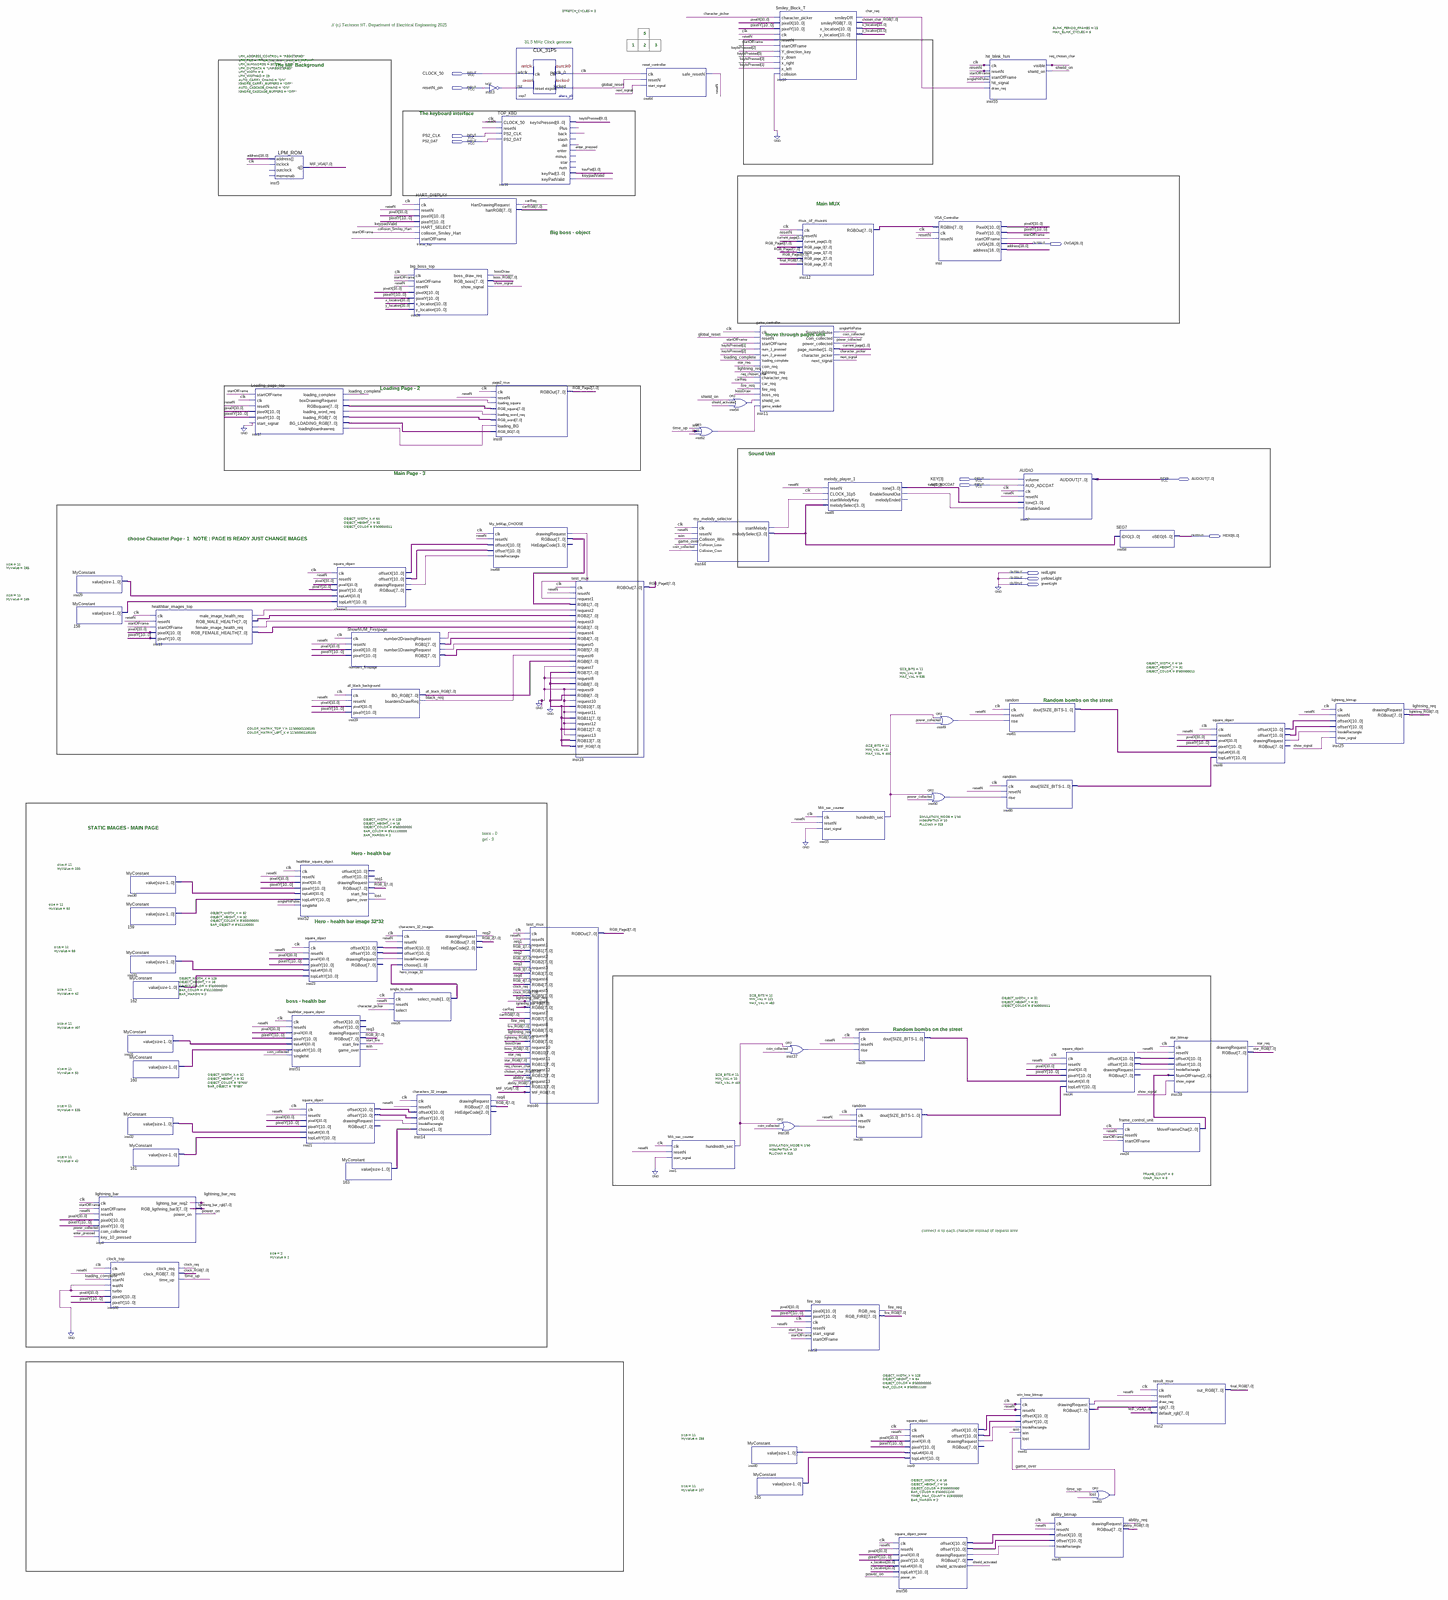
[diagram p0: schematic sheet, whole]
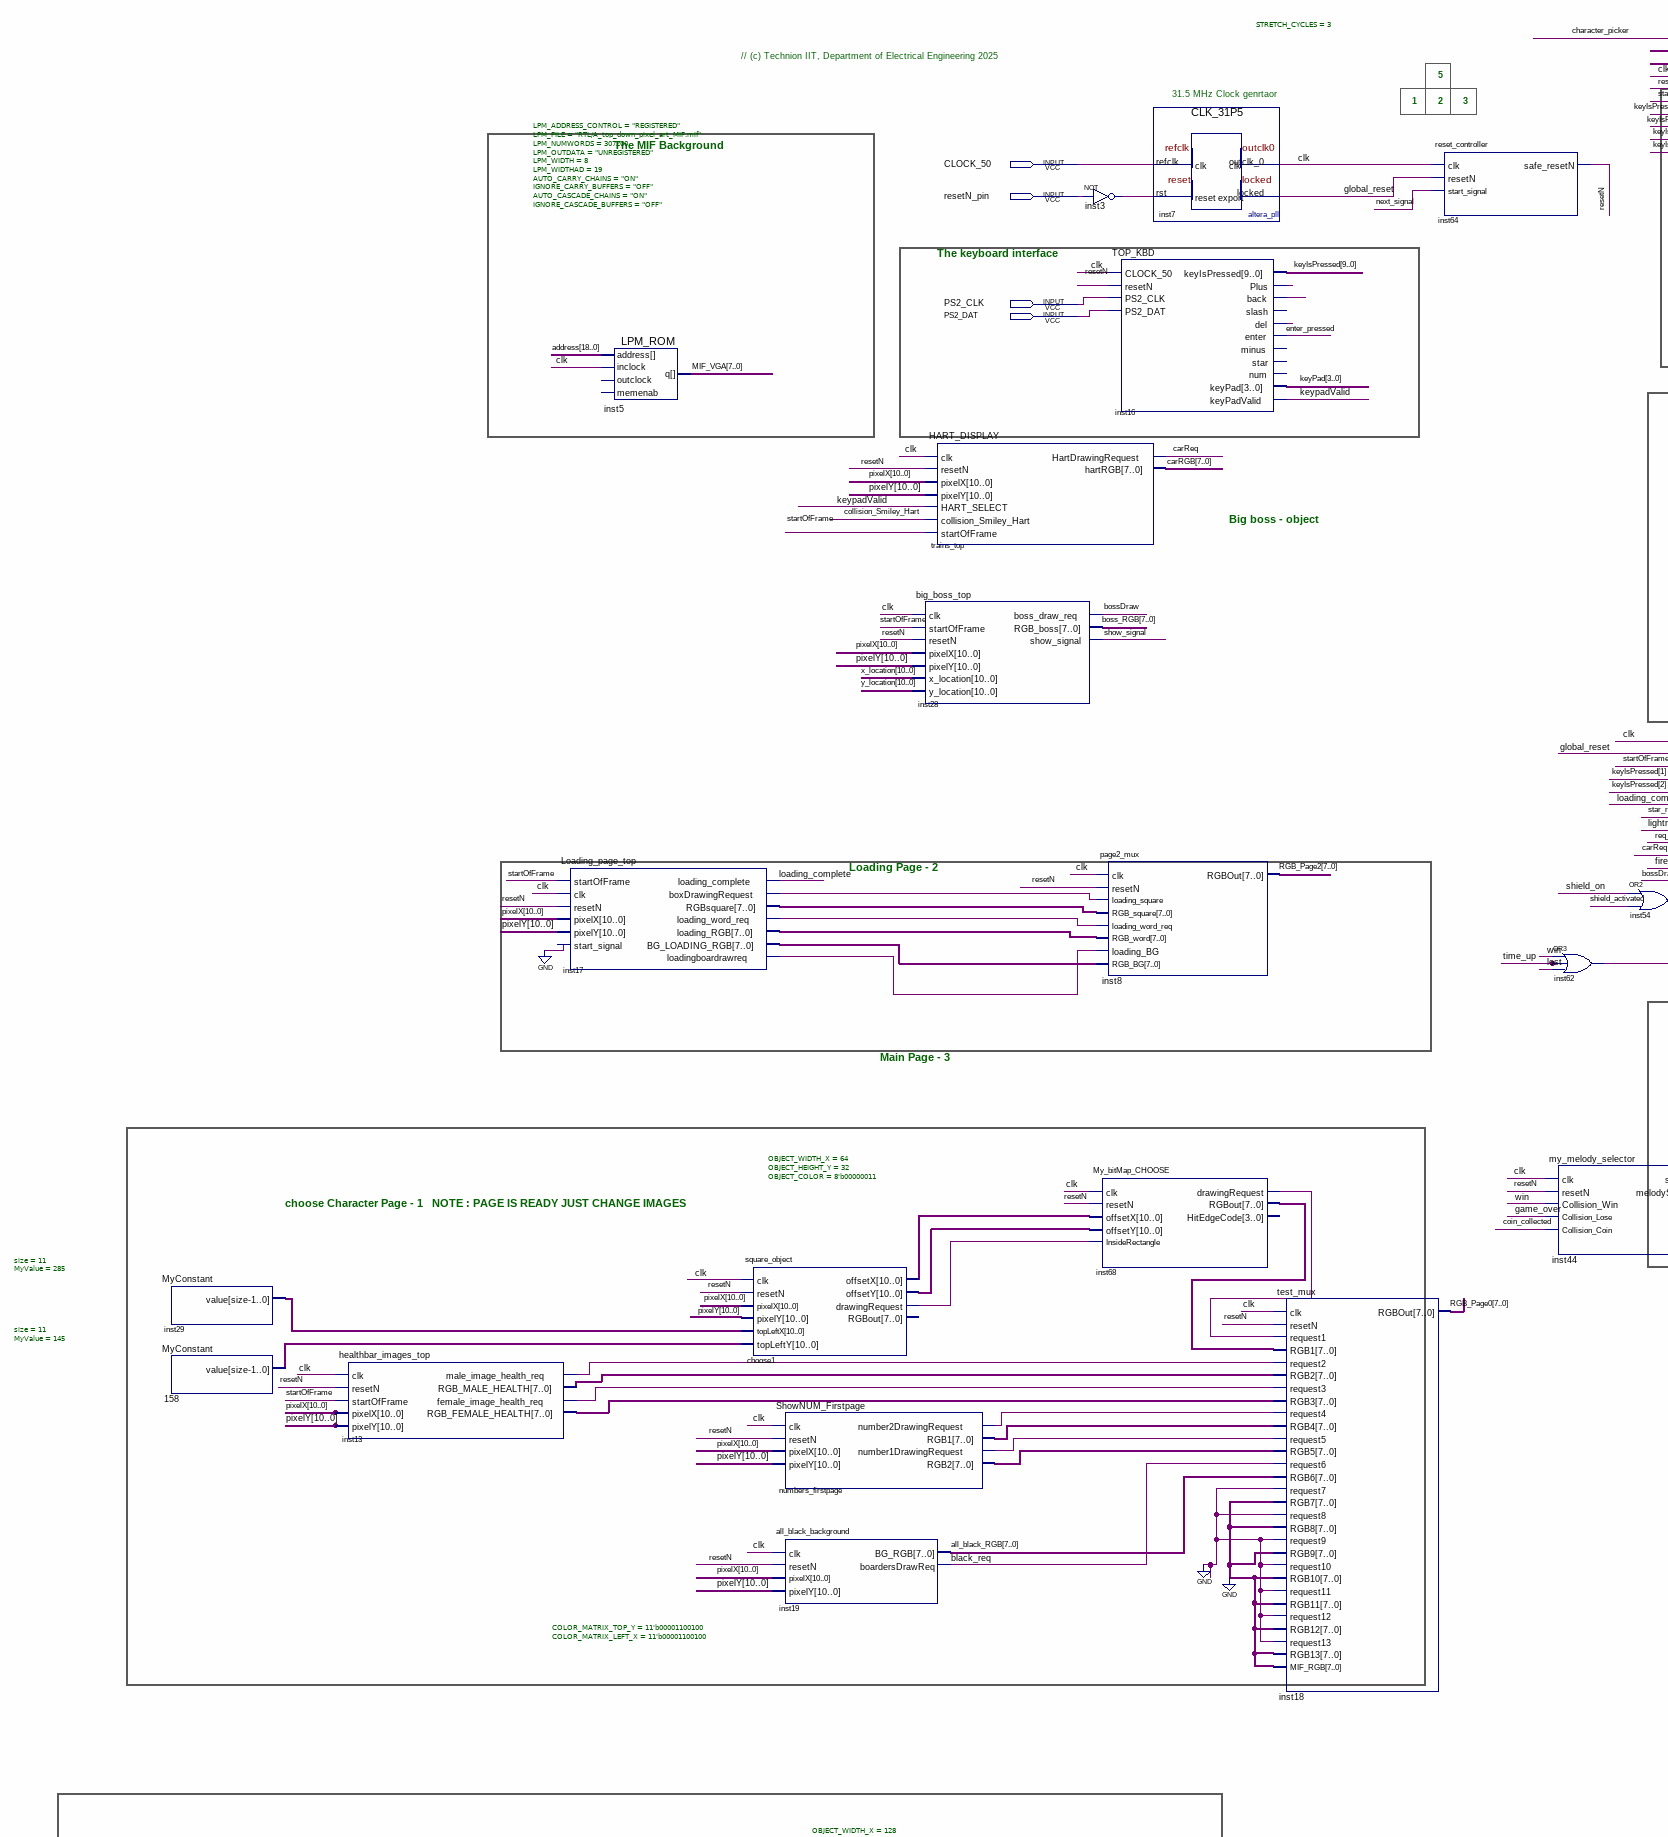
[diagram p1: schematic sheet, upper left part]
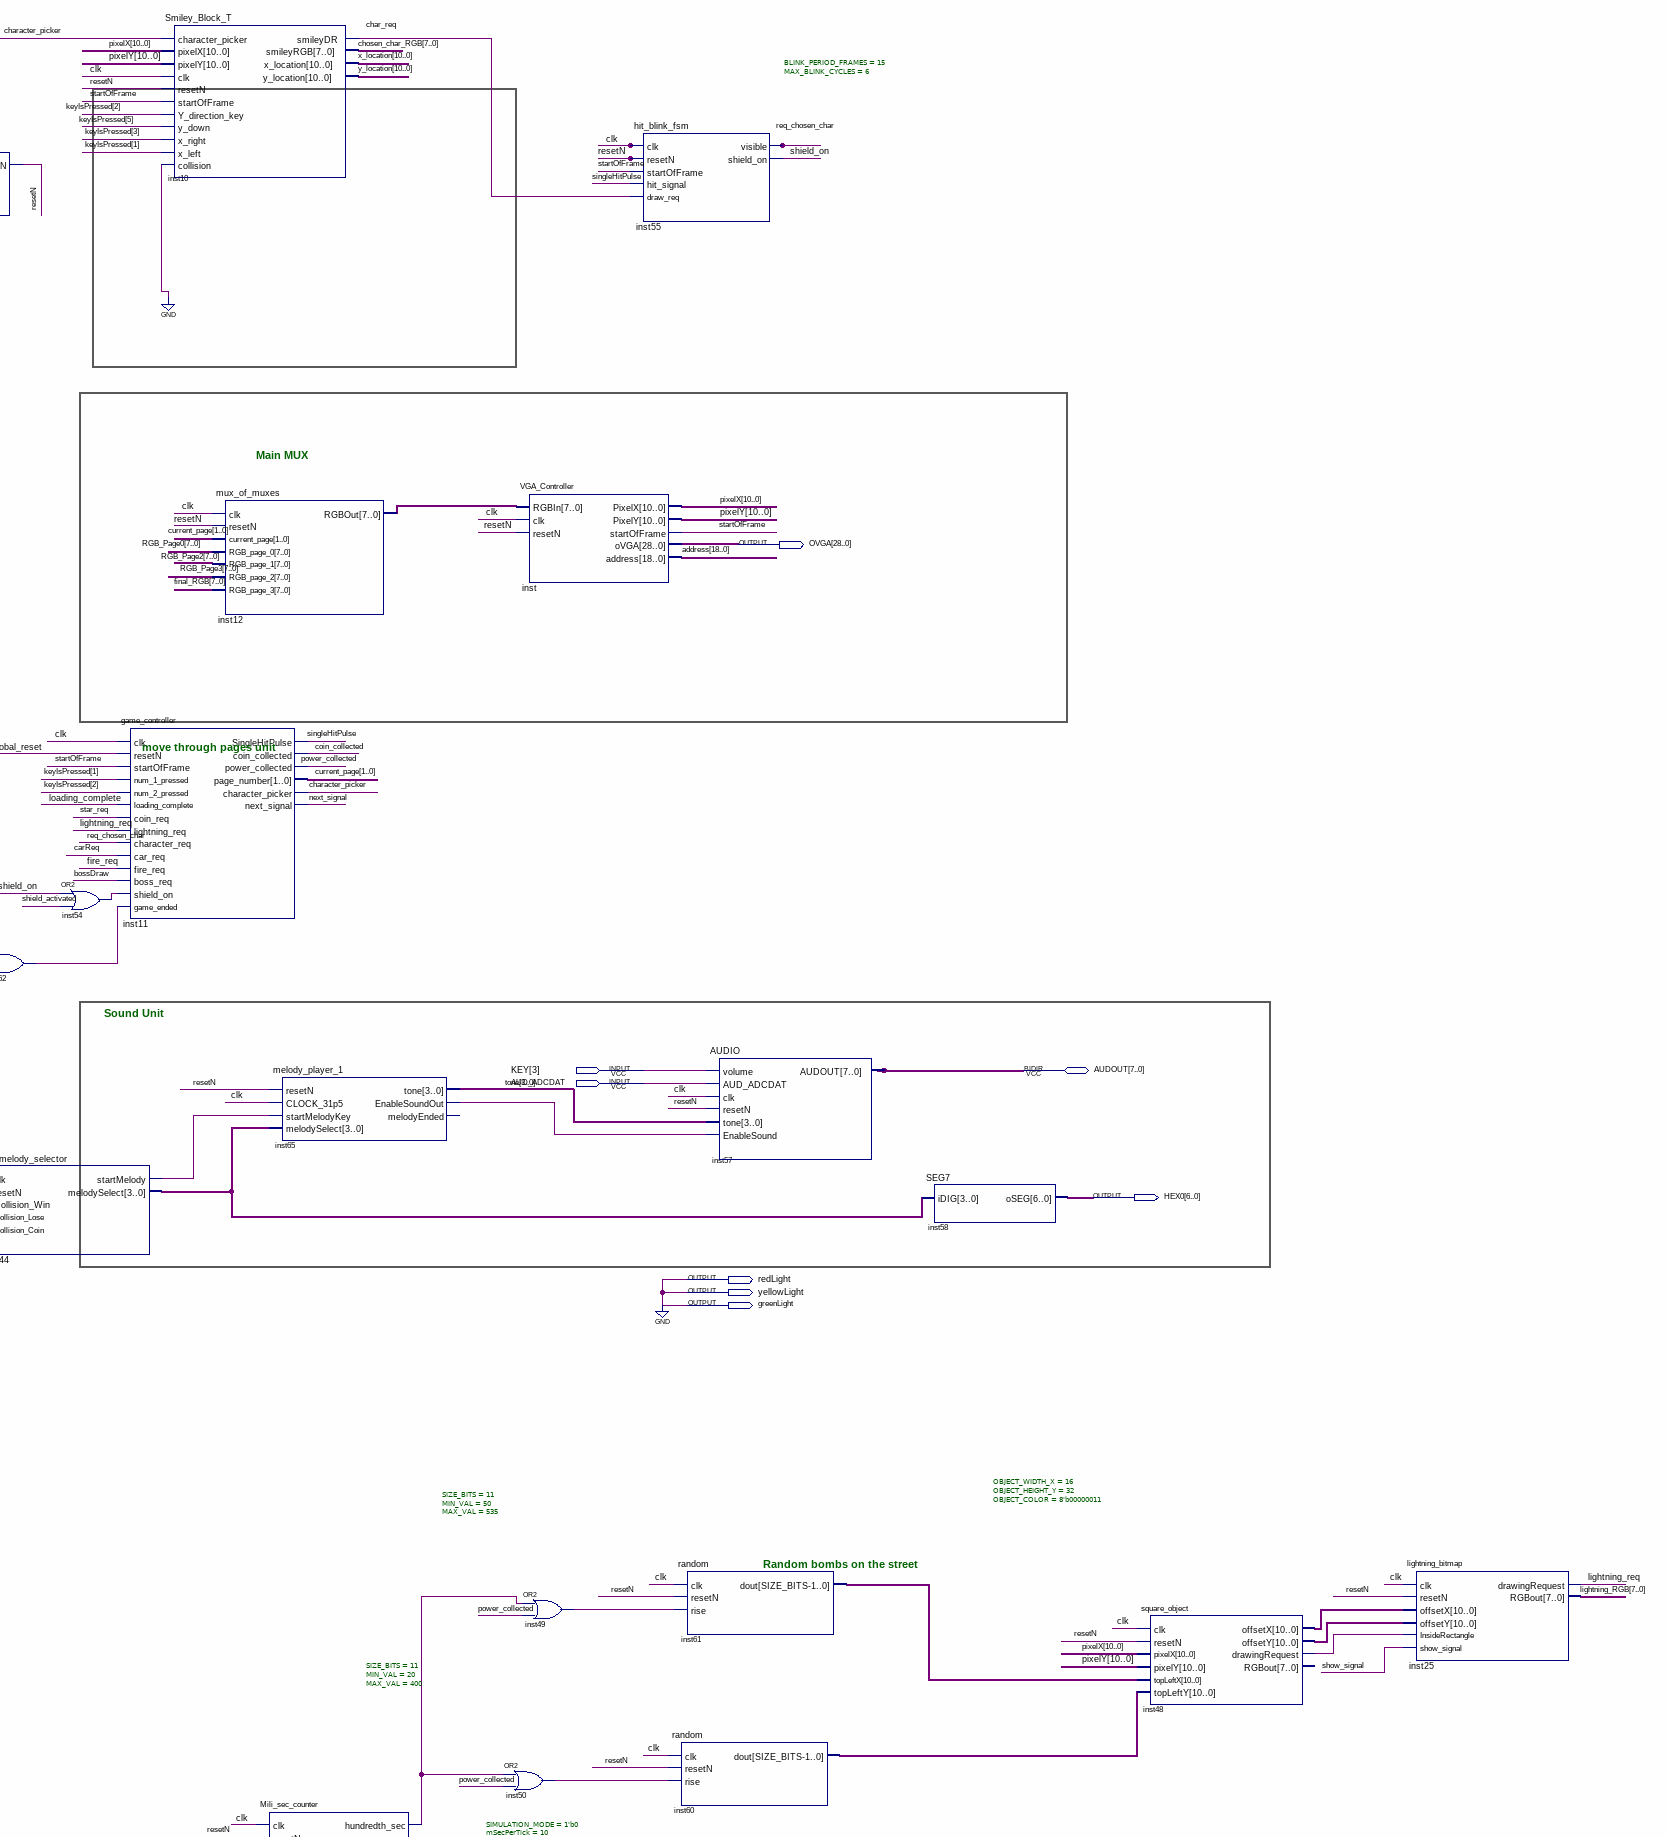
[diagram p2: schematic sheet, upper right part]
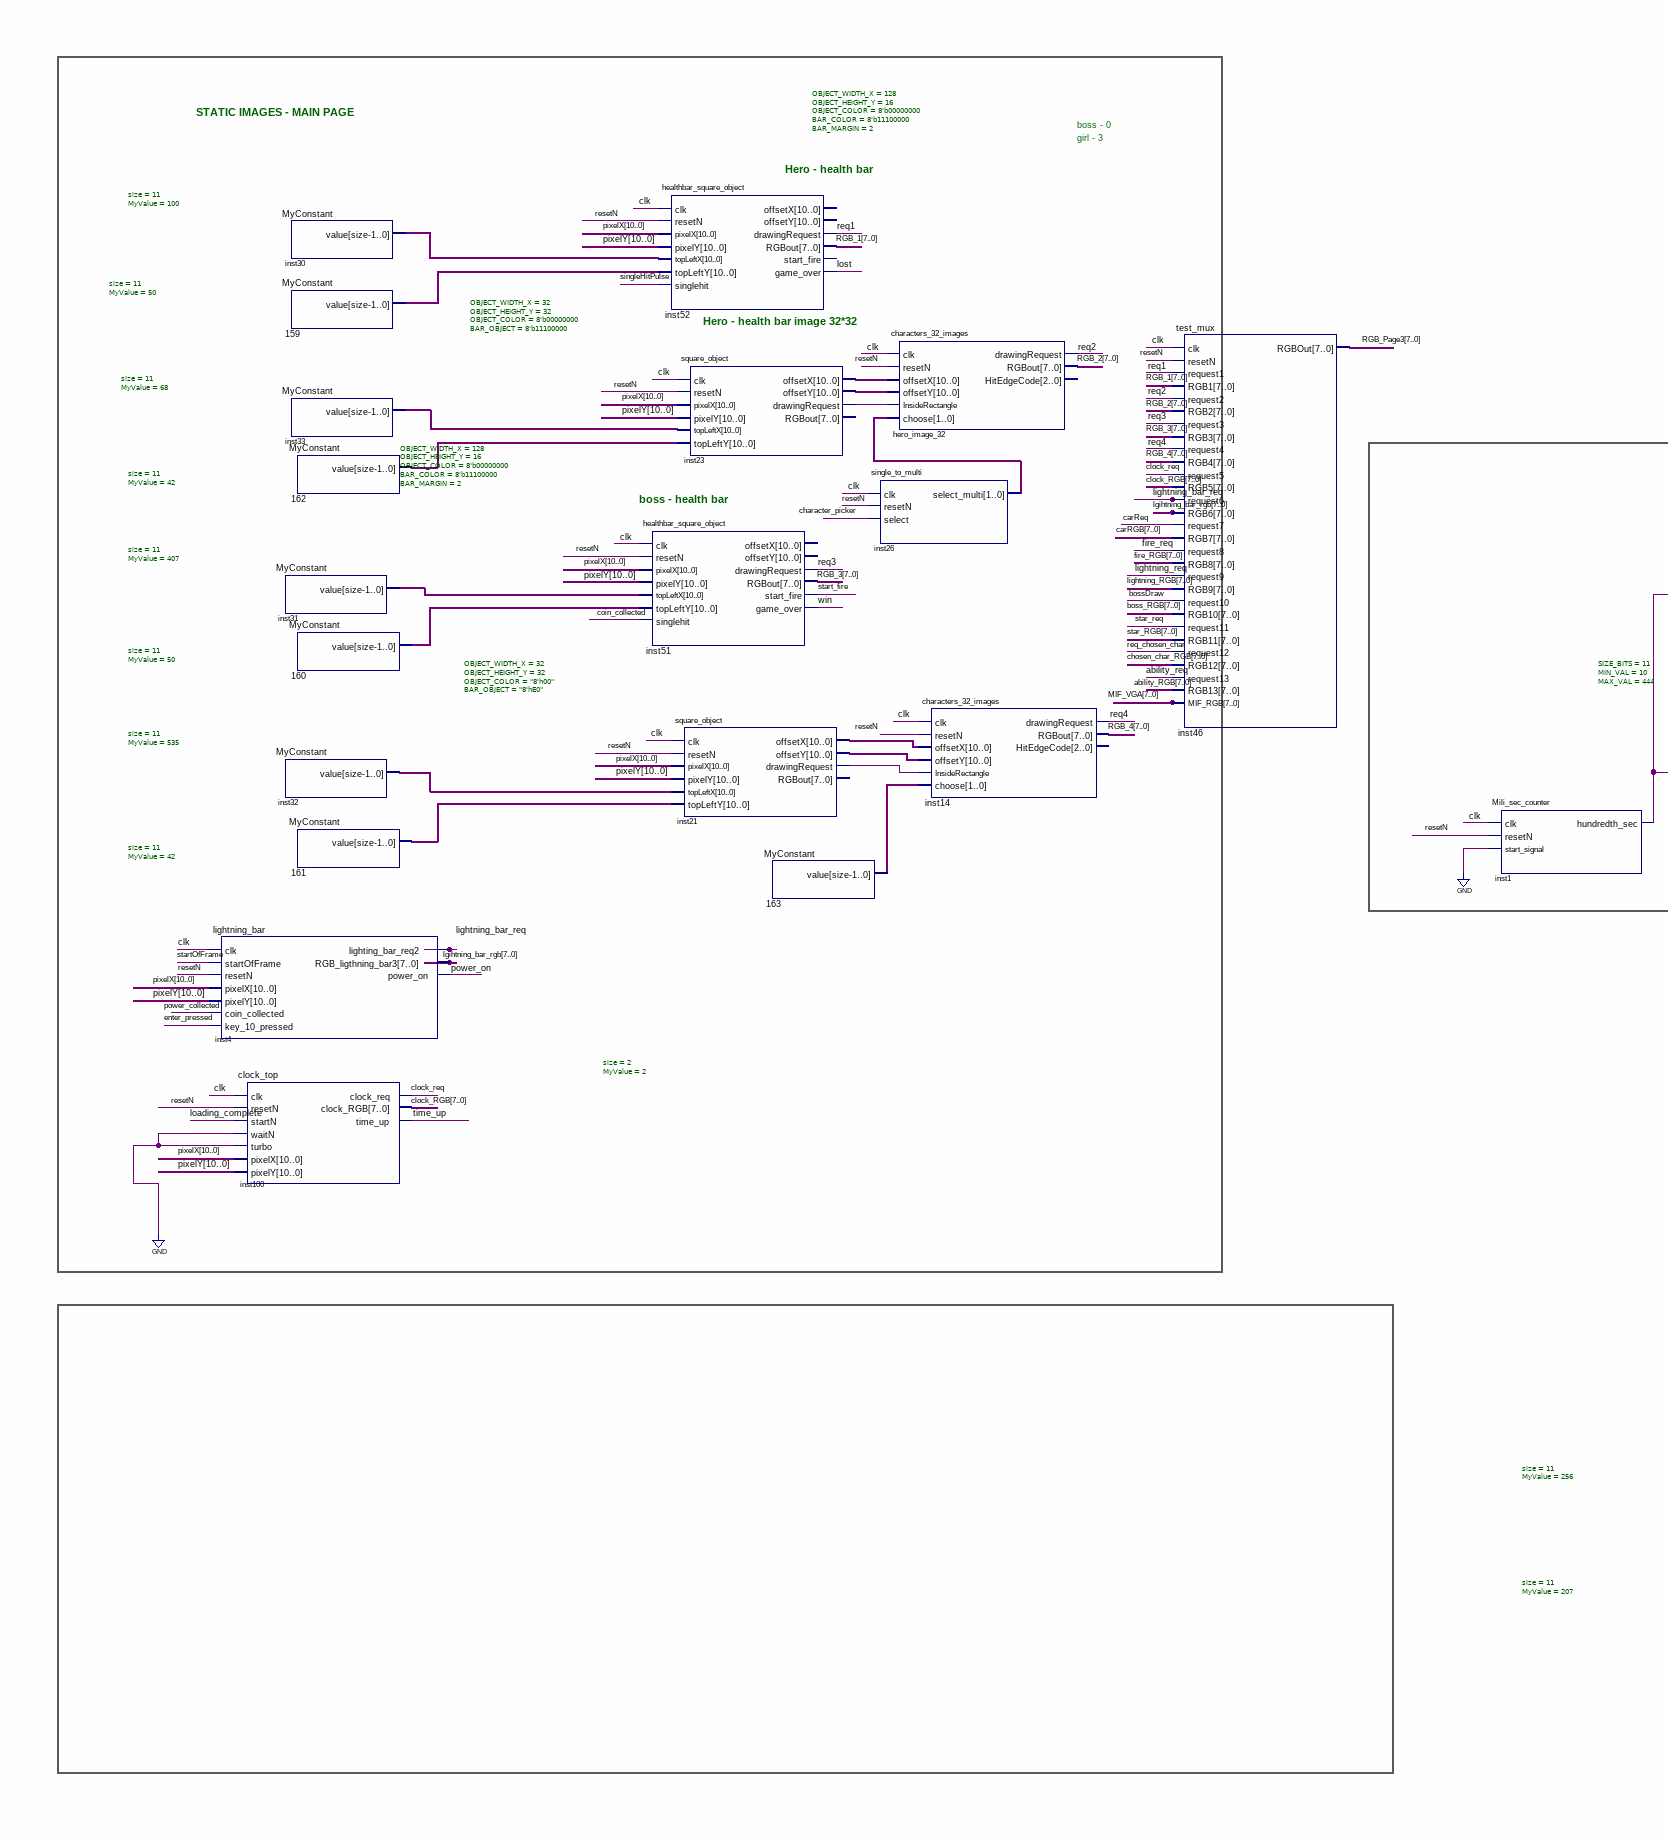
[diagram p3: schematic sheet, lower left part]
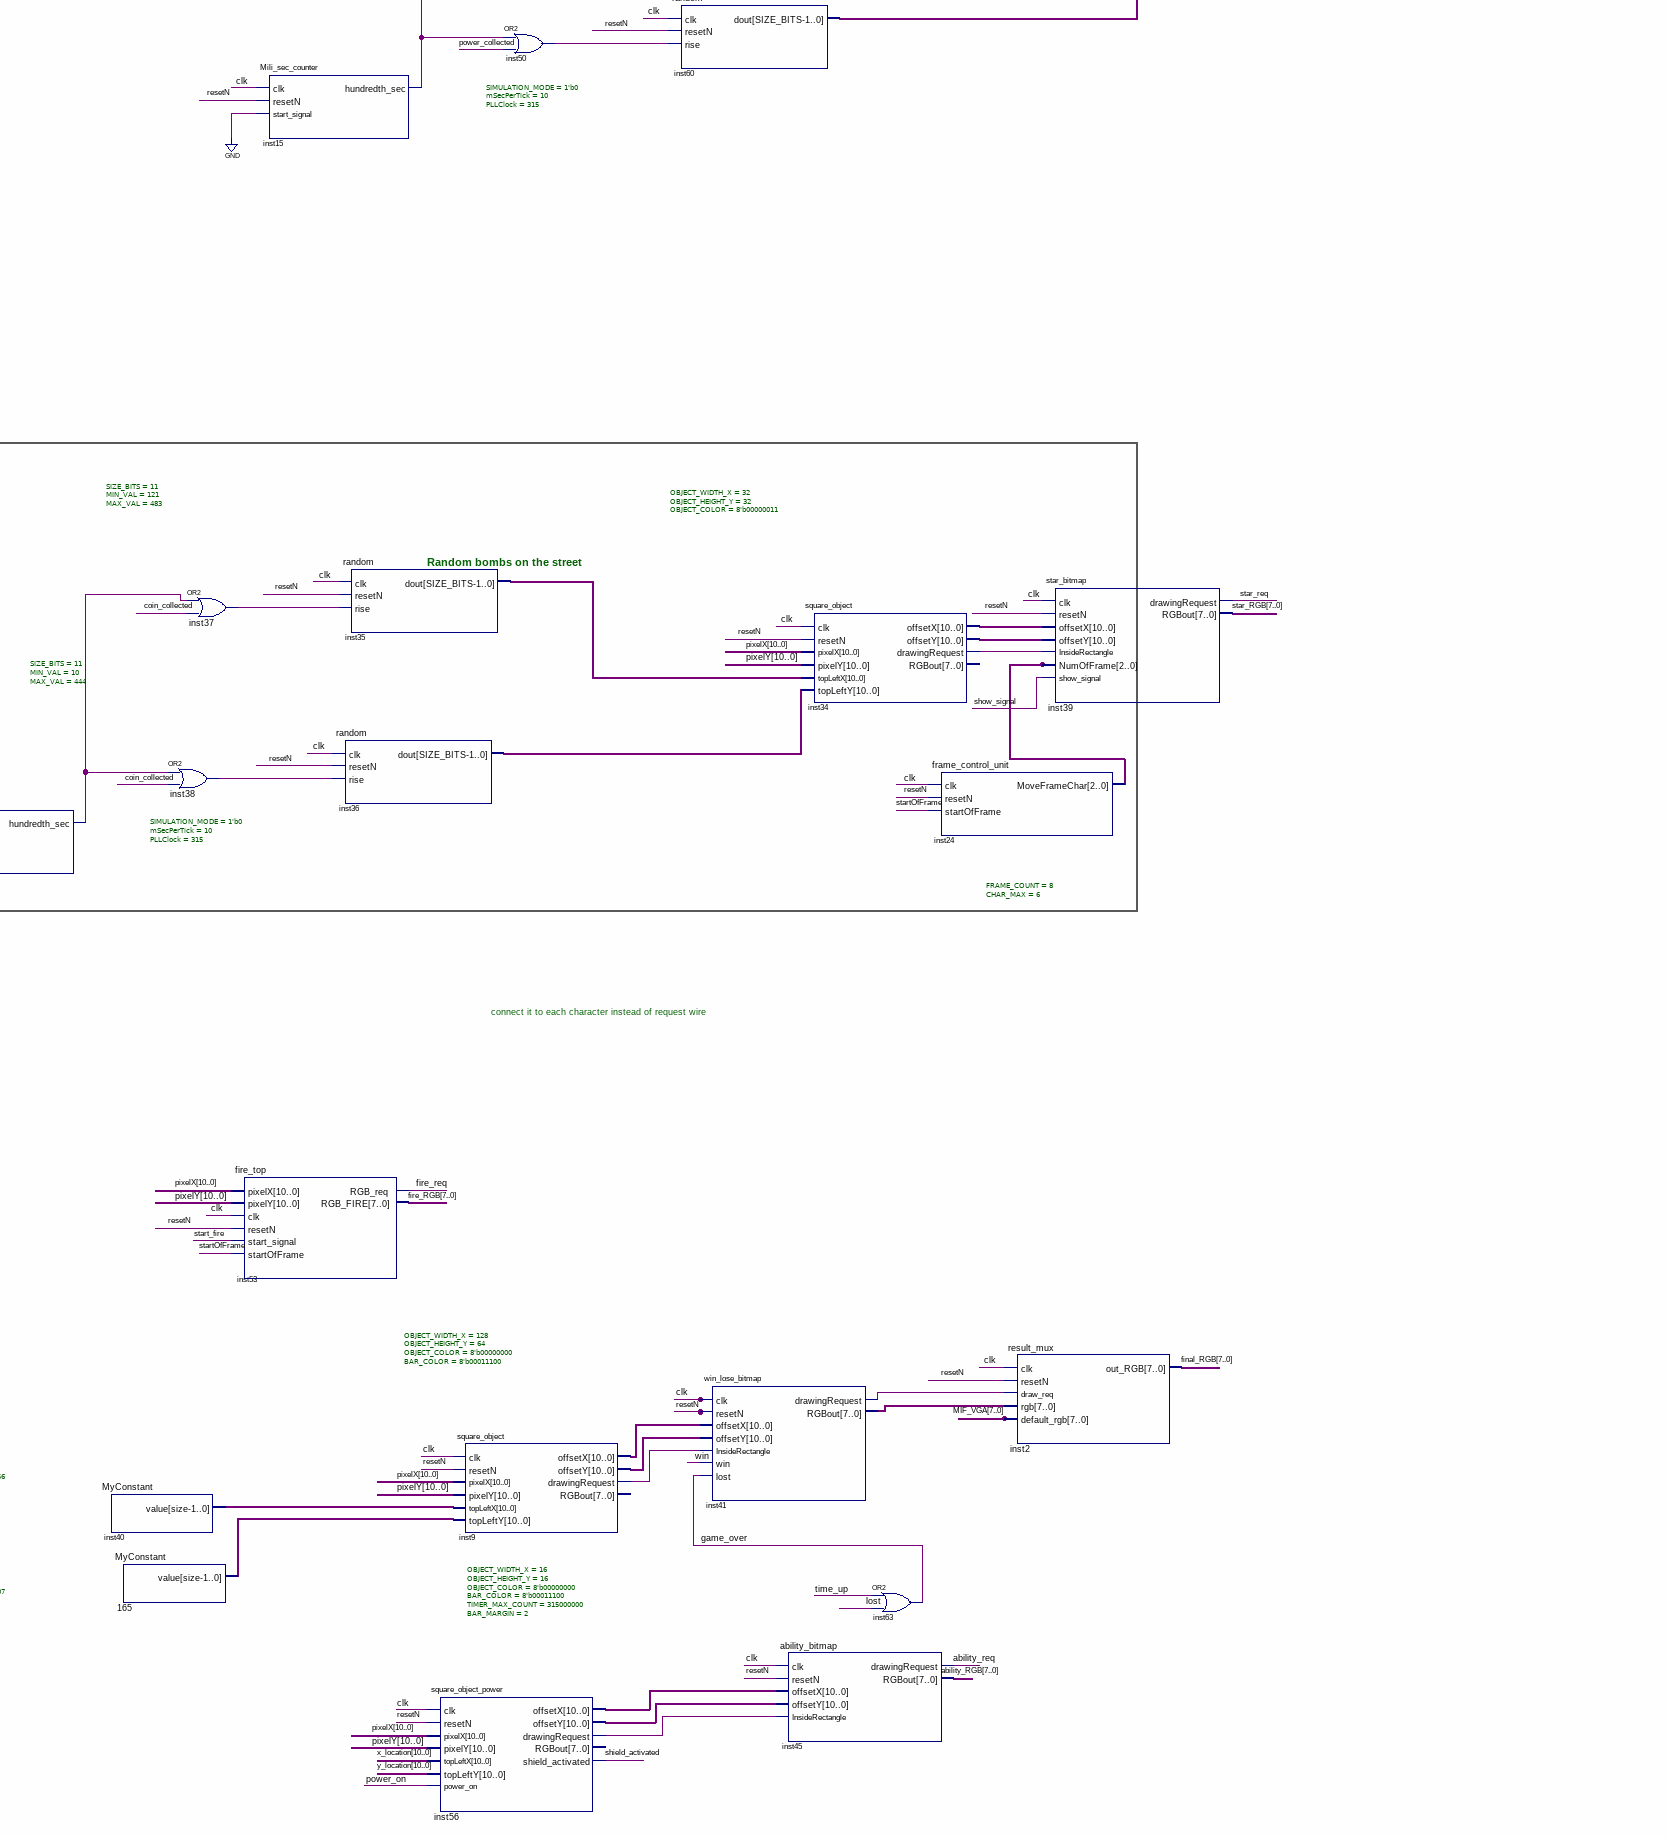
[diagram p4: schematic sheet, lower right part]
// Quartus schematic TOP_VGA_DEMO_KBD.bdf as structural Verilog: 71 symbols, 12 pins
module TOP_VGA_DEMO_KBD (
  input  CLOCK_50,
  input  resetN_pin,
  input  PS2_CLK,
  input  PS2_DAT,
  input  [3:3] KEY,
  input  AUD_ADCDAT,
  inout  [7:0] AUDOUT,
  output [28:0] OVGA,
  output [6:0] HEX0,
  output redLight,
  output yellowLight,
  output greenLight
);

  wire ability_req, black_req, bossDraw, carReq, char_req, character_picker, choose1_drawingrequest, clk,
       clock_req, coin_collected, collision_Smiley_Hart, enter_pressed, fire_req, game_over, global_reset,
       inst1_hundredth_sec, inst3_out, inst9_drawingrequest, inst13_female_image_health_req,
       inst13_male_image_health_req, inst15_hundredth_sec, inst16_back, inst16_del, inst16_plus,
       inst17_boxdrawingrequest, inst17_loading_word_req, inst17_loadingboardrawreq, inst21_drawingrequest,
       inst23_drawingrequest, inst34_drawingrequest, inst37_out, inst38_out, inst41_drawingrequest,
       inst44_startmelody, inst48_drawingrequest, inst49_out, inst50_out, inst54_out, inst56_drawingrequest,
       inst62_out, inst65_enablesoundout, inst68_drawingrequest, keypadValid, lightning_bar_req,
       lightning_req, loading_complete, lost, next_signal, numbers_firstpage_number1drawingrequest,
       numbers_firstpage_number2drawingrequest, power_collected, power_on, req1, req2, req3, req4,
       req_chosen_char, resetN, shield_activated, shield_on, show_signal, singleHitPulse, star_req,
       start_fire, startOfFrame, time_up, win;
  wire [1:0] current_page, inst26_select_multi, n163_value;
  wire [2:0] inst24_moveframechar;
  wire [3:0] inst44_melodyselect, keyPad, tone;
  wire [7:0] ability_RGB, all_black_RGB, boss_RGB, carRGB, chosen_char_RGB, clock_RGB, final_RGB, fire_RGB,
       inst12_rgbout, inst13_rgb_female_health, inst13_rgb_male_health, inst17_bg_loading_rgb,
       inst17_loading_rgb, inst17_rgbsquare, inst41_rgbout, inst68_rgbout, lgihtning_bar_rgb, lightning_RGB,
       MIF_VGA, numbers_firstpage_rgb1, numbers_firstpage_rgb2, RGB_1, RGB_2, RGB_3, RGB_4, RGB_Page0,
       RGB_Page2, RGB_Page3, star_RGB;
  wire [9:0] keyIsPressed;
  wire [10:0] choose1_offsetx, choose1_offsety, inst9_offsetx, inst9_offsety, inst21_offsetx, inst21_offsety,
       inst23_offsetx, inst23_offsety, inst29_value, inst30_value, inst31_value, inst32_value, inst33_value,
       inst34_offsetx, inst34_offsety, inst35_dout, inst36_dout, inst40_value, inst48_offsetx,
       inst48_offsety, inst56_offsetx, inst56_offsety, inst60_dout, inst61_dout, n158_value, n159_value,
       n160_value, n161_value, n162_value, n165_value, pixelX, pixelY, x_location, y_location;
  wire [18:0] address;

  MyConstant #(.size(11), .MyValue(285)) inst29 (.value(inst29_value));
  MyConstant #(.size(11), .MyValue(145)) u_158 (.value(n158_value));
  lightning_bar inst4 (
    .clk(clk), .startOfFrame(startOfFrame), .resetN(resetN), .pixelX(pixelX), .pixelY(pixelY),
    .coin_collected(power_collected), .key_10_pressed(enter_pressed), .lighting_bar_req2(lightning_bar_req),
    .RGB_ligthning_bar3(lgihtning_bar_rgb), .power_on(power_on));
  MyConstant #(.size(11), .MyValue(100)) inst30 (.value(inst30_value));
  MyConstant #(.size(11), .MyValue(50)) u_159 (.value(n159_value));
  MyConstant #(.size(11), .MyValue(68)) inst33 (.value(inst33_value));
  MyConstant #(.size(11), .MyValue(407)) inst31 (.value(inst31_value));
  MyConstant #(.size(11), .MyValue(535)) inst32 (.value(inst32_value));
  clock_top inst100 (
    .clk(clk), .resetN(resetN), .startN(loading_complete), .waitN(1'b0), .turbo(1'b0), .pixelX(pixelX),
    .pixelY(pixelY), .clock_req(clock_req), .clock_RGB(clock_RGB), .time_up(time_up));
  MyConstant #(.size(11), .MyValue(42)) u_162 (.value(n162_value));
  MyConstant #(.size(11), .MyValue(50)) u_160 (.value(n160_value));
  MyConstant #(.size(11), .MyValue(42)) u_161 (.value(n161_value));
  healthbar_images_top inst13 (
    .clk(clk), .resetN(resetN), .startOfFrame(startOfFrame), .pixelX(pixelX), .pixelY(pixelY),
    .male_image_health_req(inst13_male_image_health_req), .RGB_MALE_HEALTH(inst13_rgb_male_health),
    .female_image_health_req(inst13_female_image_health_req), .RGB_FEMALE_HEALTH(inst13_rgb_female_health));
  Loading_page_top inst17 (
    .startOfFrame(startOfFrame), .clk(clk), .resetN(resetN), .pixelX(pixelX), .pixelY(pixelY),
    .start_signal(1'b0), .loading_complete(loading_complete), .boxDrawingRequest(inst17_boxdrawingrequest),
    .RGBsquare(inst17_rgbsquare), .loading_word_req(inst17_loading_word_req),
    .loading_RGB(inst17_loading_rgb), .BG_LOADING_RGB(inst17_bg_loading_rgb),
    .loadingboardrawreq(inst17_loadingboardrawreq));
  LPM_ROM #(.LPM_ADDRESS_CONTROL("REGISTERED"), .LPM_FILE("RTL/A_top_down_pixel_art_MIF.mif"), .LPM_NUMWORDS(307200), .LPM_OUTDATA("UNREGISTERED"), .LPM_WIDTH(8), .LPM_WIDTHAD(19), .AUTO_CARRY_CHAINS("ON"), .IGNORE_CARRY_BUFFERS("OFF"), .AUTO_CASCADE_CHAINS("ON"), .IGNORE_CASCADE_BUFFERS("OFF")) inst5 (
    .address(address), .inclock(clk), .q(MIF_VGA));  // open: outclock, memenab
  healthbar_square_object #(.OBJECT_WIDTH_X(128), .OBJECT_HEIGHT_Y(16), .OBJECT_COLOR(8'b00000000), .BAR_COLOR(8'b11100000), .BAR_MARGIN(2)) inst52 (
    .clk(clk), .resetN(resetN), .pixelX(pixelX), .pixelY(pixelY), .topLeftX(inst30_value),
    .topLeftY(n159_value), .singlehit(singleHitPulse), .drawingRequest(req1), .RGBout(RGB_1), .game_over(lost));  // open: offsetX, offsetY, start_fire
  square_object #(.OBJECT_WIDTH_X(32), .OBJECT_HEIGHT_Y(32), .OBJECT_COLOR(8'b00000000), .BAR_OBJECT(8'b11100000)) inst23 (
    .clk(clk), .resetN(resetN), .pixelX(pixelX), .pixelY(pixelY), .topLeftX(inst33_value),
    .topLeftY(n162_value), .offsetX(inst23_offsetx), .offsetY(inst23_offsety),
    .drawingRequest(inst23_drawingrequest));  // open: RGBout
  healthbar_square_object #(.OBJECT_WIDTH_X(128), .OBJECT_HEIGHT_Y(16), .OBJECT_COLOR(8'b00000000), .BAR_COLOR(8'b11100000), .BAR_MARGIN(2)) inst51 (
    .clk(clk), .resetN(resetN), .pixelX(pixelX), .pixelY(pixelY), .topLeftX(inst31_value),
    .topLeftY(n160_value), .singlehit(coin_collected), .drawingRequest(req3), .RGBout(RGB_3),
    .start_fire(start_fire), .game_over(win));  // open: offsetX, offsetY
  square_object #(.OBJECT_WIDTH_X(32), .OBJECT_HEIGHT_Y(32), .OBJECT_COLOR("8'h00"), .BAR_OBJECT("8'hE0")) inst21 (
    .clk(clk), .resetN(resetN), .pixelX(pixelX), .pixelY(pixelY), .topLeftX(inst32_value),
    .topLeftY(n161_value), .offsetX(inst21_offsetx), .offsetY(inst21_offsety),
    .drawingRequest(inst21_drawingrequest));  // open: RGBout
  square_object #(.OBJECT_WIDTH_X(64), .OBJECT_HEIGHT_Y(32), .OBJECT_COLOR(8'b00000011)) choose1 (
    .clk(clk), .resetN(resetN), .pixelX(pixelX), .pixelY(pixelY), .topLeftX(inst29_value),
    .topLeftY(n158_value), .offsetX(choose1_offsetx), .offsetY(choose1_offsety),
    .drawingRequest(choose1_drawingrequest));  // open: RGBout
  ShowNUM_Firstpage numbers_firstpage (
    .clk(clk), .resetN(resetN), .pixelX(pixelX), .pixelY(pixelY),
    .number2DrawingRequest(numbers_firstpage_number2drawingrequest), .RGB1(numbers_firstpage_rgb1),
    .number1DrawingRequest(numbers_firstpage_number1drawingrequest), .RGB2(numbers_firstpage_rgb2));
  all_black_background #(.COLOR_MATRIX_TOP_Y(11'b00001100100), .COLOR_MATRIX_LEFT_X(11'b00001100100)) inst19 (
    .clk(clk), .resetN(resetN), .pixelX(pixelX), .pixelY(pixelY), .BG_RGB(all_black_RGB),
    .boardersDrawReq(black_req));
  MyConstant #(.size(2), .MyValue(2)) u_163 (.value(n163_value));
  characters_32_images hero_image_32 (
    .clk(clk), .resetN(resetN), .offsetX(inst23_offsetx), .offsetY(inst23_offsety),
    .InsideRectangle(inst23_drawingrequest), .choose(inst26_select_multi), .drawingRequest(req2),
    .RGBout(RGB_2));  // open: HitEdgeCode
  single_to_multi inst26 (.clk(clk), .resetN(resetN), .select(character_picker), .select_multi(inst26_select_multi));
  HART_DISPLAY trains_top (
    .clk(clk), .resetN(resetN), .pixelX(pixelX), .pixelY(pixelY), .HART_SELECT(keypadValid),
    .collision_Smiley_Hart(collision_Smiley_Hart), .startOfFrame(startOfFrame), .HartDrawingRequest(carReq),
    .hartRGB(carRGB));
  big_boss_top inst28 (
    .clk(clk), .startOfFrame(startOfFrame), .resetN(resetN), .pixelX(pixelX), .pixelY(pixelY),
    .x_location(x_location), .y_location(y_location), .boss_draw_req(bossDraw), .RGB_boss(boss_RGB),
    .show_signal(show_signal));
  characters_32_images inst14 (
    .clk(clk), .resetN(resetN), .offsetX(inst21_offsetx), .offsetY(inst21_offsety),
    .InsideRectangle(inst21_drawingrequest), .choose(n163_value), .drawingRequest(req4), .RGBout(RGB_4));  // open: HitEdgeCode
  not inst3 (inst3_out, resetN_pin);
  My_bitMap_CHOOSE inst68 (
    .clk(clk), .resetN(resetN), .offsetX(choose1_offsetx), .offsetY(choose1_offsety),
    .InsideRectangle(choose1_drawingrequest), .drawingRequest(inst68_drawingrequest), .RGBout(inst68_rgbout));  // open: HitEdgeCode
  TOP_KBD inst16 (
    .CLOCK_50(clk), .resetN(resetN), .PS2_CLK(PS2_CLK), .PS2_DAT(PS2_DAT), .keyIsPressed(keyIsPressed),
    .Plus(inst16_plus), .back(inst16_back), .del(inst16_del), .enter(enter_pressed), .keyPad(keyPad),
    .keyPadValid(keypadValid));  // open: slash, minus, star, num
  page2_mux inst8 (
    .clk(clk), .resetN(resetN), .loading_square(inst17_boxdrawingrequest), .RGB_square(inst17_rgbsquare),
    .loading_word_req(inst17_loading_word_req), .RGB_word(inst17_loading_rgb),
    .loading_BG(inst17_loadingboardrawreq), .RGB_BG(inst17_bg_loading_rgb), .RGBOut(RGB_Page2));
  CLK_31P5 inst7 (.refclk(CLOCK_50), .rst(inst3_out), .outclk_0(clk), .locked(global_reset));
  test_mux inst46 (
    .clk(clk), .resetN(resetN), .request1(req1), .RGB1(RGB_1), .request2(req2), .RGB2(RGB_2),
    .request3(req3), .RGB3(RGB_3), .request4(req4), .RGB4(RGB_4), .request5(clock_req), .RGB5(clock_RGB),
    .request6(lightning_bar_req), .RGB6(lgihtning_bar_rgb), .request7(carReq), .RGB7(carRGB),
    .request8(fire_req), .RGB8(fire_RGB), .request9(lightning_req), .RGB9(lightning_RGB),
    .request10(bossDraw), .RGB10(boss_RGB), .request11(star_req), .RGB11(star_RGB),
    .request12(req_chosen_char), .RGB12(chosen_char_RGB), .request13(ability_req), .RGB13(ability_RGB),
    .MIF_RGB(MIF_VGA), .RGBOut(RGB_Page3));
  test_mux inst18 (
    .clk(clk), .resetN(resetN), .request1(inst68_drawingrequest), .RGB1(inst68_rgbout),
    .request2(inst13_male_image_health_req), .RGB2(inst13_rgb_male_health),
    .request3(inst13_female_image_health_req), .RGB3(inst13_rgb_female_health),
    .request4(numbers_firstpage_number2drawingrequest), .RGB4(numbers_firstpage_rgb1),
    .request5(numbers_firstpage_number1drawingrequest), .RGB5(numbers_firstpage_rgb2), .request6(black_req),
    .RGB6(all_black_RGB), .request7(1'b0), .RGB7({8{1'b0}}), .request8(1'b0), .RGB8({8{1'b0}}),
    .request9(1'b0), .RGB9({8{1'b0}}), .request10(1'b0), .RGB10({8{1'b0}}), .request11(1'b0),
    .RGB11({8{1'b0}}), .request12(1'b0), .RGB12({8{1'b0}}), .request13(1'b0), .RGB13({8{1'b0}}),
    .MIF_RGB({8{1'b0}}), .RGBOut(RGB_Page0));
  reset_controller #(.STRETCH_CYCLES(3)) inst64 (
    .clk(clk), .resetN(global_reset), .start_signal(next_signal), .safe_resetN(resetN));
  Mili_sec_counter #(.SIMULATION_MODE(1'b0), .mSecPerTick(10), .PLLClock(315)) inst1 (
    .clk(clk), .resetN(resetN), .start_signal(1'b0), .hundredth_sec(inst1_hundredth_sec));
  my_melody_selector inst44 (
    .clk(clk), .resetN(resetN), .Collision_Win(win), .Collision_Lose(game_over),
    .Collision_Coin(coin_collected), .startMelody(inst44_startmelody), .melodySelect(inst44_melodyselect));
  or inst62 (inst62_out, win, time_up, lost);
  or inst54 (inst54_out, shield_on, shield_activated);
  game_controller inst11 (
    .clk(clk), .resetN(global_reset), .startOfFrame(startOfFrame), .num_1_pressed(keyIsPressed[1]),
    .num_2_pressed(keyIsPressed[2]), .loading_complete(loading_complete), .coin_req(star_req),
    .lightning_req(lightning_req), .character_req(req_chosen_char), .car_req(carReq), .fire_req(fire_req),
    .boss_req(bossDraw), .shield_on(inst54_out), .game_ended(inst62_out), .SingleHitPulse(singleHitPulse),
    .coin_collected(coin_collected), .power_collected(power_collected), .page_number(current_page),
    .character_picker(character_picker), .next_signal(next_signal));
  MyConstant #(.size(11), .MyValue(256)) inst40 (.value(inst40_value));
  MyConstant #(.size(11), .MyValue(207)) u_165 (.value(n165_value));
  Smiley_Block_T inst10 (
    .character_picker(character_picker), .pixelX(pixelX), .pixelY(pixelY), .clk(clk), .resetN(resetN),
    .startOfFrame(startOfFrame), .Y_direction_key(keyIsPressed[2]), .y_down(keyIsPressed[5]),
    .x_right(keyIsPressed[3]), .x_left(keyIsPressed[1]), .collision(1'b0), .smileyDR(char_req),
    .smileyRGB(chosen_char_RGB), .x_location(x_location), .y_location(y_location));
  or inst38 (inst38_out, inst1_hundredth_sec, coin_collected);
  mux_of_muxes inst12 (
    .clk(clk), .resetN(resetN), .current_page(current_page), .RGB_page_0(RGB_Page0), .RGB_page_1(RGB_Page2),
    .RGB_page_2(RGB_Page3), .RGB_page_3(final_RGB), .RGBOut(inst12_rgbout));
  or inst37 (inst37_out, inst1_hundredth_sec, coin_collected);
  fire_top inst53 (
    .pixelX(pixelX), .pixelY(pixelY), .clk(clk), .resetN(resetN), .start_signal(start_fire),
    .startOfFrame(startOfFrame), .RGB_req(fire_req), .RGB_FIRE(fire_RGB));
  melody_player_1 inst65 (
    .resetN(resetN), .CLOCK_31p5(clk), .startMelodyKey(inst44_startmelody),
    .melodySelect(inst44_melodyselect), .tone(tone), .EnableSoundOut(inst65_enablesoundout));  // open: melodyEnded
  Mili_sec_counter #(.SIMULATION_MODE(1'b0), .mSecPerTick(10), .PLLClock(315)) inst15 (
    .clk(clk), .resetN(resetN), .start_signal(1'b0), .hundredth_sec(inst15_hundredth_sec));
  random #(.SIZE_BITS(11), .MIN_VAL(10), .MAX_VAL(444)) inst36 (
    .clk(clk), .resetN(resetN), .rise(inst38_out), .dout(inst36_dout));
  random #(.SIZE_BITS(11), .MIN_VAL(121), .MAX_VAL(483)) inst35 (
    .clk(clk), .resetN(resetN), .rise(inst37_out), .dout(inst35_dout));
  square_object_power #(.OBJECT_WIDTH_X(16), .OBJECT_HEIGHT_Y(16), .OBJECT_COLOR(8'b00000000), .BAR_COLOR(8'b00011100), .TIMER_MAX_COUNT(315000000), .BAR_MARGIN(2)) inst56 (
    .clk(clk), .resetN(resetN), .pixelX(pixelX), .pixelY(pixelY), .topLeftX(x_location),
    .topLeftY(y_location), .power_on(power_on), .offsetX(inst56_offsetx), .offsetY(inst56_offsety),
    .drawingRequest(inst56_drawingrequest), .shield_activated(shield_activated));  // open: RGBout
  square_object #(.OBJECT_WIDTH_X(128), .OBJECT_HEIGHT_Y(64), .OBJECT_COLOR(8'b00000000), .BAR_COLOR(8'b00011100)) inst9 (
    .clk(clk), .resetN(resetN), .pixelX(pixelX), .pixelY(pixelY), .topLeftX(inst40_value),
    .topLeftY(n165_value), .offsetX(inst9_offsetx), .offsetY(inst9_offsety),
    .drawingRequest(inst9_drawingrequest));  // open: RGBout
  VGA_Controller inst (
    .RGBIn(inst12_rgbout), .clk(clk), .resetN(resetN), .PixelX(pixelX), .PixelY(pixelY),
    .startOfFrame(startOfFrame), .oVGA(OVGA), .address(address));
  or inst49 (inst49_out, inst15_hundredth_sec, power_collected);
  or inst50 (inst50_out, inst15_hundredth_sec, power_collected);
  hit_blink_fsm #(.BLINK_PERIOD_FRAMES(15), .MAX_BLINK_CYCLES(6)) inst55 (
    .clk(clk), .resetN(resetN), .startOfFrame(startOfFrame), .hit_signal(singleHitPulse),
    .draw_req(char_req), .visible(req_chosen_char), .shield_on(shield_on));
  random #(.SIZE_BITS(11), .MIN_VAL(50), .MAX_VAL(535)) inst61 (
    .clk(clk), .resetN(resetN), .rise(inst49_out), .dout(inst61_dout));
  random #(.SIZE_BITS(11), .MIN_VAL(20), .MAX_VAL(400)) inst60 (
    .clk(clk), .resetN(resetN), .rise(inst50_out), .dout(inst60_dout));
  AUDIO inst57 (
    .volume(KEY[3]), .AUD_ADCDAT(AUD_ADCDAT), .clk(clk), .resetN(resetN), .tone(tone),
    .EnableSound(inst65_enablesoundout), .AUDOUT(AUDOUT));
  win_lose_bitmap inst41 (
    .clk(clk), .resetN(resetN), .offsetX(inst9_offsetx), .offsetY(inst9_offsety),
    .InsideRectangle(inst9_drawingrequest), .win(win), .lost(game_over),
    .drawingRequest(inst41_drawingrequest), .RGBout(inst41_rgbout));
  ability_bitmap inst45 (
    .clk(clk), .resetN(resetN), .offsetX(inst56_offsetx), .offsetY(inst56_offsety),
    .InsideRectangle(inst56_drawingrequest), .drawingRequest(ability_req), .RGBout(ability_RGB));
  square_object #(.OBJECT_WIDTH_X(32), .OBJECT_HEIGHT_Y(32), .OBJECT_COLOR(8'b00000011)) inst34 (
    .clk(clk), .resetN(resetN), .pixelX(pixelX), .pixelY(pixelY), .topLeftX(inst35_dout),
    .topLeftY(inst36_dout), .offsetX(inst34_offsetx), .offsetY(inst34_offsety),
    .drawingRequest(inst34_drawingrequest));  // open: RGBout
  or inst63 (game_over, time_up, lost);
  SEG7 inst58 (.iDIG(inst44_melodyselect), .oSEG(HEX0));
  frame_control_unit #(.FRAME_COUNT(8), .CHAR_MAX(6)) inst24 (
    .clk(clk), .resetN(resetN), .startOfFrame(startOfFrame), .MoveFrameChar(inst24_moveframechar));
  star_bitmap inst39 (
    .clk(clk), .resetN(resetN), .offsetX(inst34_offsetx), .offsetY(inst34_offsety),
    .InsideRectangle(inst34_drawingrequest), .NumOfFrame(inst24_moveframechar), .show_signal(show_signal),
    .drawingRequest(star_req), .RGBout(star_RGB));
  result_mux inst2 (
    .clk(clk), .resetN(resetN), .draw_req(inst41_drawingrequest), .rgb(inst41_rgbout), .default_rgb(MIF_VGA),
    .out_RGB(final_RGB));
  square_object #(.OBJECT_WIDTH_X(16), .OBJECT_HEIGHT_Y(32), .OBJECT_COLOR(8'b00000011)) inst48 (
    .clk(clk), .resetN(resetN), .pixelX(pixelX), .pixelY(pixelY), .topLeftX(inst61_dout),
    .topLeftY(inst60_dout), .offsetX(inst48_offsetx), .offsetY(inst48_offsety),
    .drawingRequest(inst48_drawingrequest));  // open: RGBout
  lightning_bitmap inst25 (
    .clk(clk), .resetN(resetN), .offsetX(inst48_offsetx), .offsetY(inst48_offsety),
    .InsideRectangle(inst48_drawingrequest), .show_signal(show_signal), .drawingRequest(lightning_req),
    .RGBout(lightning_RGB));

  assign greenLight = 1'b0;
  assign redLight = 1'b0;
  assign yellowLight = 1'b0;

  // Notes on the sheet:
  //   // (c) Technion IIT, Department of Electrical Engineering 2025
  //   5
  //   31.5 MHz Clock genrtaor
  //   1
  //   2
  //   3
  //   The MIF Background
  //   The keyboard interface
  //   Main MUX  
  //   Big boss - object
  //   move through pages unit   
  //   Loading Page - 2     
  //   Sound Unit
  //   Main Page - 3   
  //   choose Character Page - 1   NOTE : PAGE IS READY JUST CHANGE IMAGES            
  //   Random bombs on the street
  //   STATIC IMAGES - MAIN PAGE 
  //   boss - 0 
  //   girl - 3 
  //   Hero - health bar 
  //   Hero - health bar image 32*32
  //   boss - health bar
  //   Random bombs on the street
  //   connect it to each character instead of request wire
endmodule
